# EAGLE design Filters (EAGLE 9.6.2)
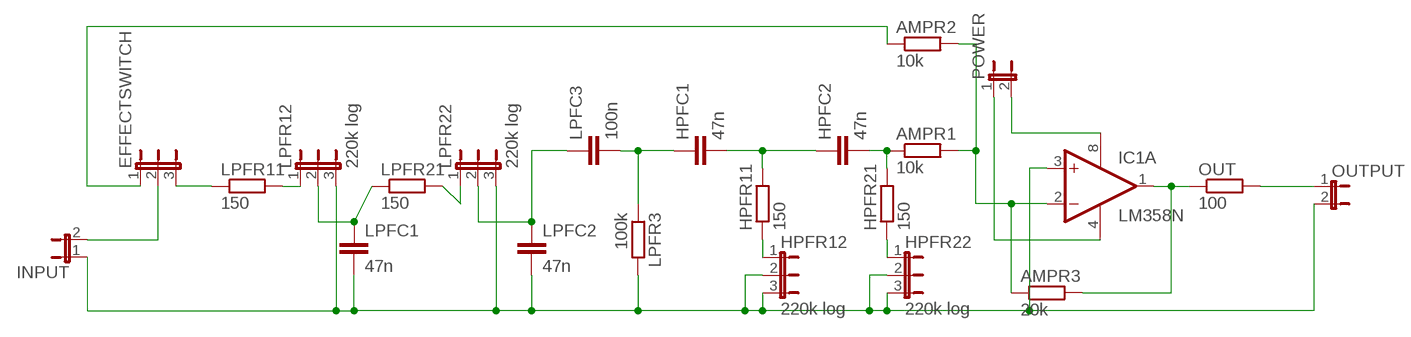
[diagram p0: schematic, sheet 1]

## Parts
AMPR1  10k  R-EU_0207/10  [0207/10]
AMPR2  10k  R-EU_0207/10  [0207/10]
AMPR3  20k  R-EU_0207/10  [0207/10]
EFFECTSWITCH  220k log  JP2E  [JP2]
HPFC1  47n  C-EU025-025X050  [C025-025X050]
HPFC2  47n  C-EU025-025X050  [C025-025X050]
HPFR11  150  R-EU_0207/10  [0207/10]
HPFR12  220k log  JP2E  [JP2]
HPFR21  150  R-EU_0207/10  [0207/10]
HPFR22  220k log  JP2E  [JP2]
IC1  LM358N  [DIL08]
INPUT  JP1E  [JP1]
LPFC1  47n  C-EU025-025X050  [C025-025X050]
LPFC2  47n  C-EU025-025X050  [C025-025X050]
LPFC3  100n  C-EU025-025X050  [C025-025X050]
LPFR3  100k  R-EU_0207/10  [0207/10]
LPFR11  150  R-EU_0207/10  [0207/10]
LPFR12  220k log  JP2E  [JP2]
LPFR21  150  R-EU_0207/10  [0207/10]
LPFR22  220k log  JP2E  [JP2]
OUT  100  R-EU_0207/10  [0207/10]
OUTPUT  JP1E  [JP1]
POWER  JP1E  [JP1]

## Nets
N$1: LPFR11.2 LPFR12.1
N$2: LPFC1.1 LPFR12.2 LPFR21.1
N$3: LPFC2.1 LPFC3.1 LPFR22.2
N$4: HPFR12.2 HPFR12.3 HPFR22.2 HPFR22.3 IC1.3(A:+IN) INPUT.1 LPFC1.2 LPFC2.2 LPFR3.2 LPFR12.3 LPFR22.3 OUTPUT.2
N$5: EFFECTSWITCH.3 LPFR11.1
N$6: HPFC1.2 HPFC2.1 HPFR11.2
N$8: AMPR3.2 IC1.1(A:OUT) OUT.1
N$9: IC1.8(P:V+) POWER.2
N$10: IC1.4(P:V-) POWER.1
N$11: OUT.2 OUTPUT.1
N$12: AMPR2.1 EFFECTSWITCH.1
N$13: LPFR21.2 LPFR22.1
N$14: HPFR21.1 HPFR22.1
N$15: AMPR1.1 HPFC2.2 HPFR21.2
N$16: HPFR11.1 HPFR12.1
N$19: HPFC1.1 LPFC3.2 LPFR3.1
N$21: EFFECTSWITCH.2 INPUT.2
N$22: AMPR1.2 AMPR2.2 AMPR3.1 IC1.2(A:-IN)
Unconnected: IC1.5(B:+IN) IC1.6(B:-IN) IC1.7(B:OUT)

## Library data of the parts
AMPR1-AMPR3 HPFR11 HPFR21 LPFR3 LPFR11 LPFR21 OUT = rcl:R-EU_: RESISTOR, European symbol; SPICEPREFIX: R
EFFECTSWITCH HPFR12 HPFR22 LPFR12 LPFR22 = jumper:JP2E: JUMPER
HPFC1 HPFC2 LPFC1-LPFC3 = rcl:C-EU: CAPACITOR, European symbol; SPICEPREFIX: C
IC1 = linear:LM358: OP AMP also LM158; LM258; LM2904 Source: http://cache.national.com/ds/LM/LM158.pdf
INPUT OUTPUT POWER = jumper:JP1E: JUMPER

## Board
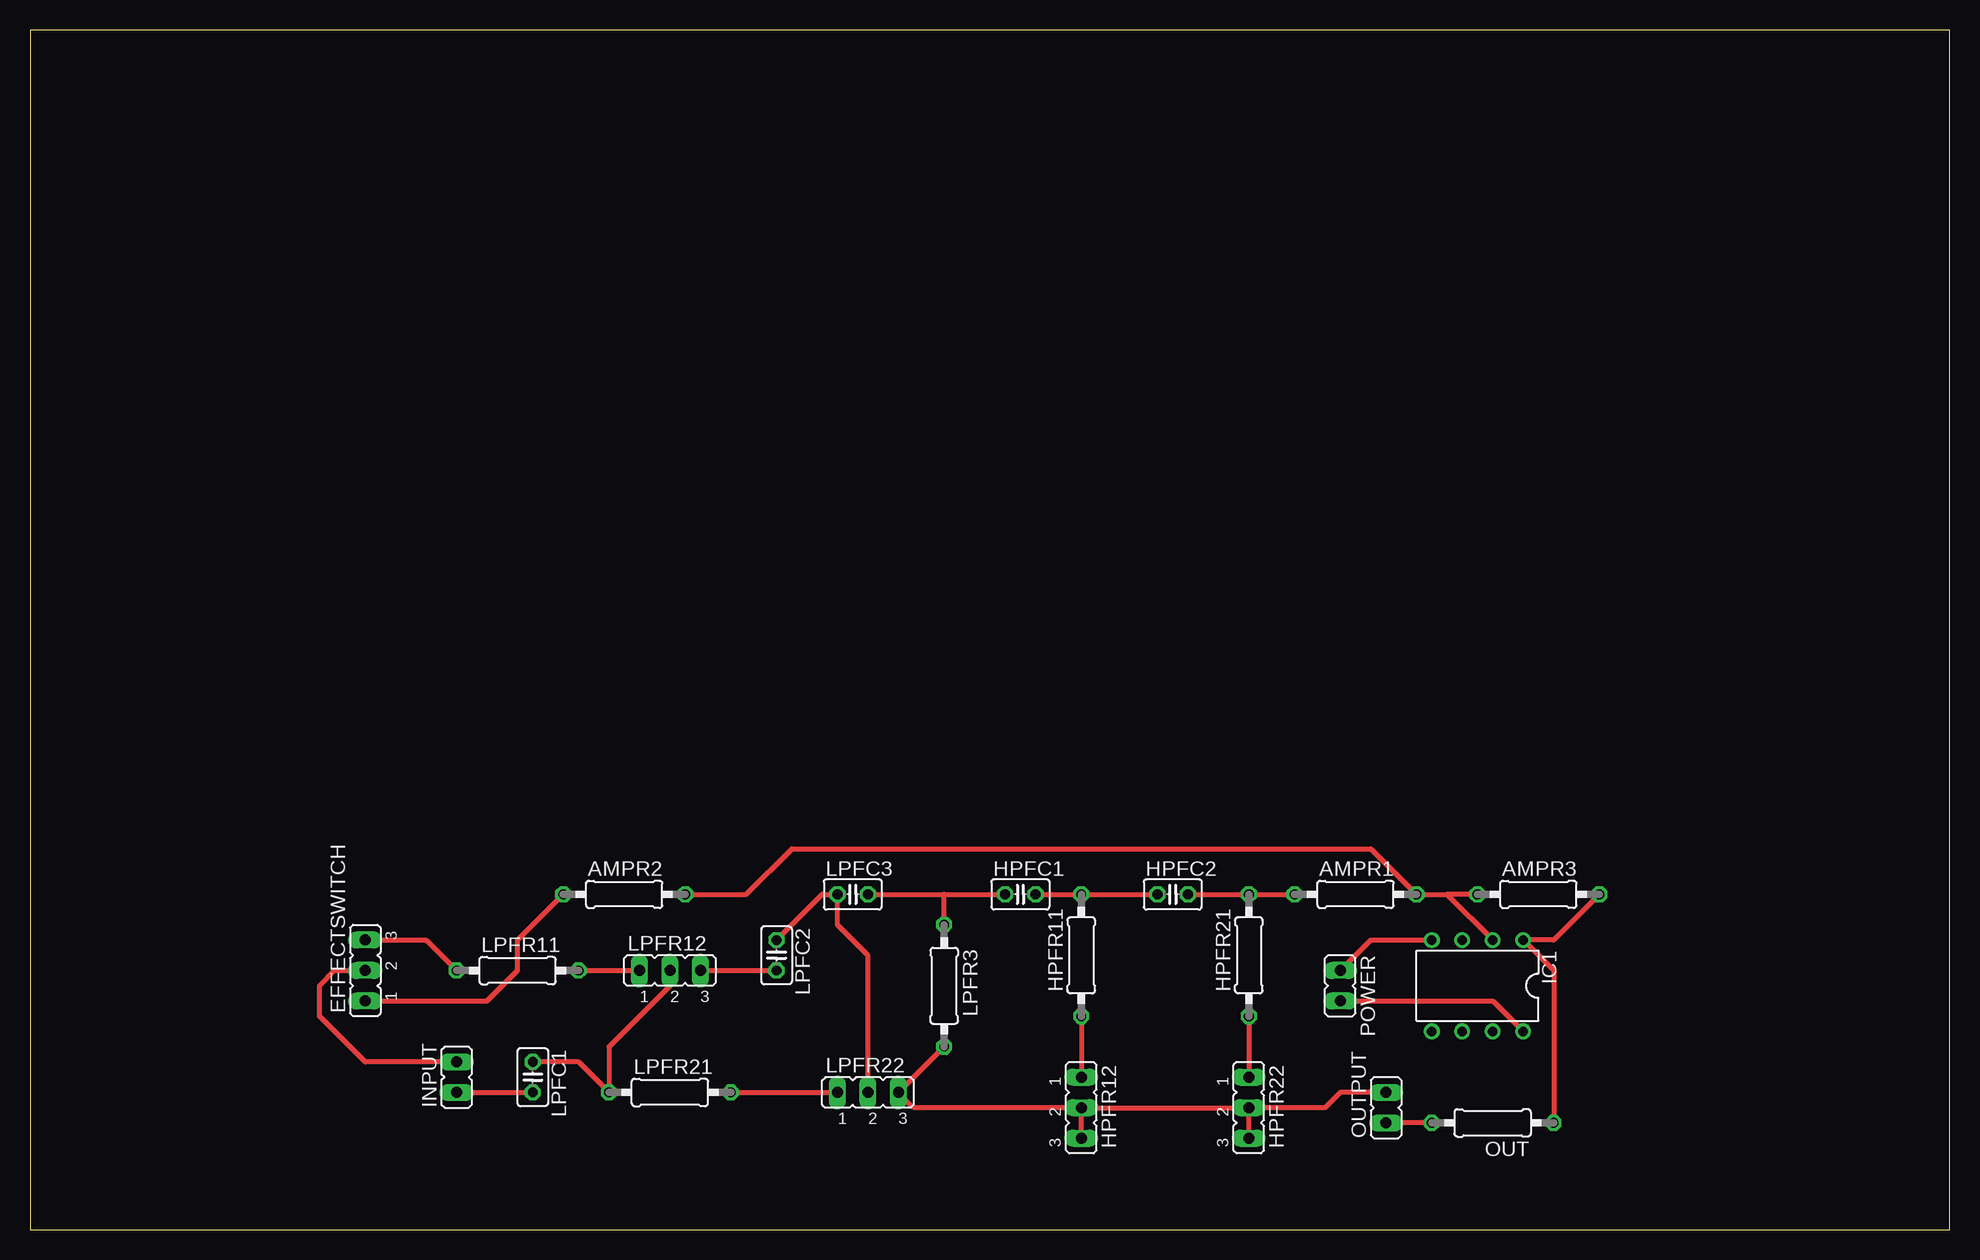
[diagram p1: board, top side]
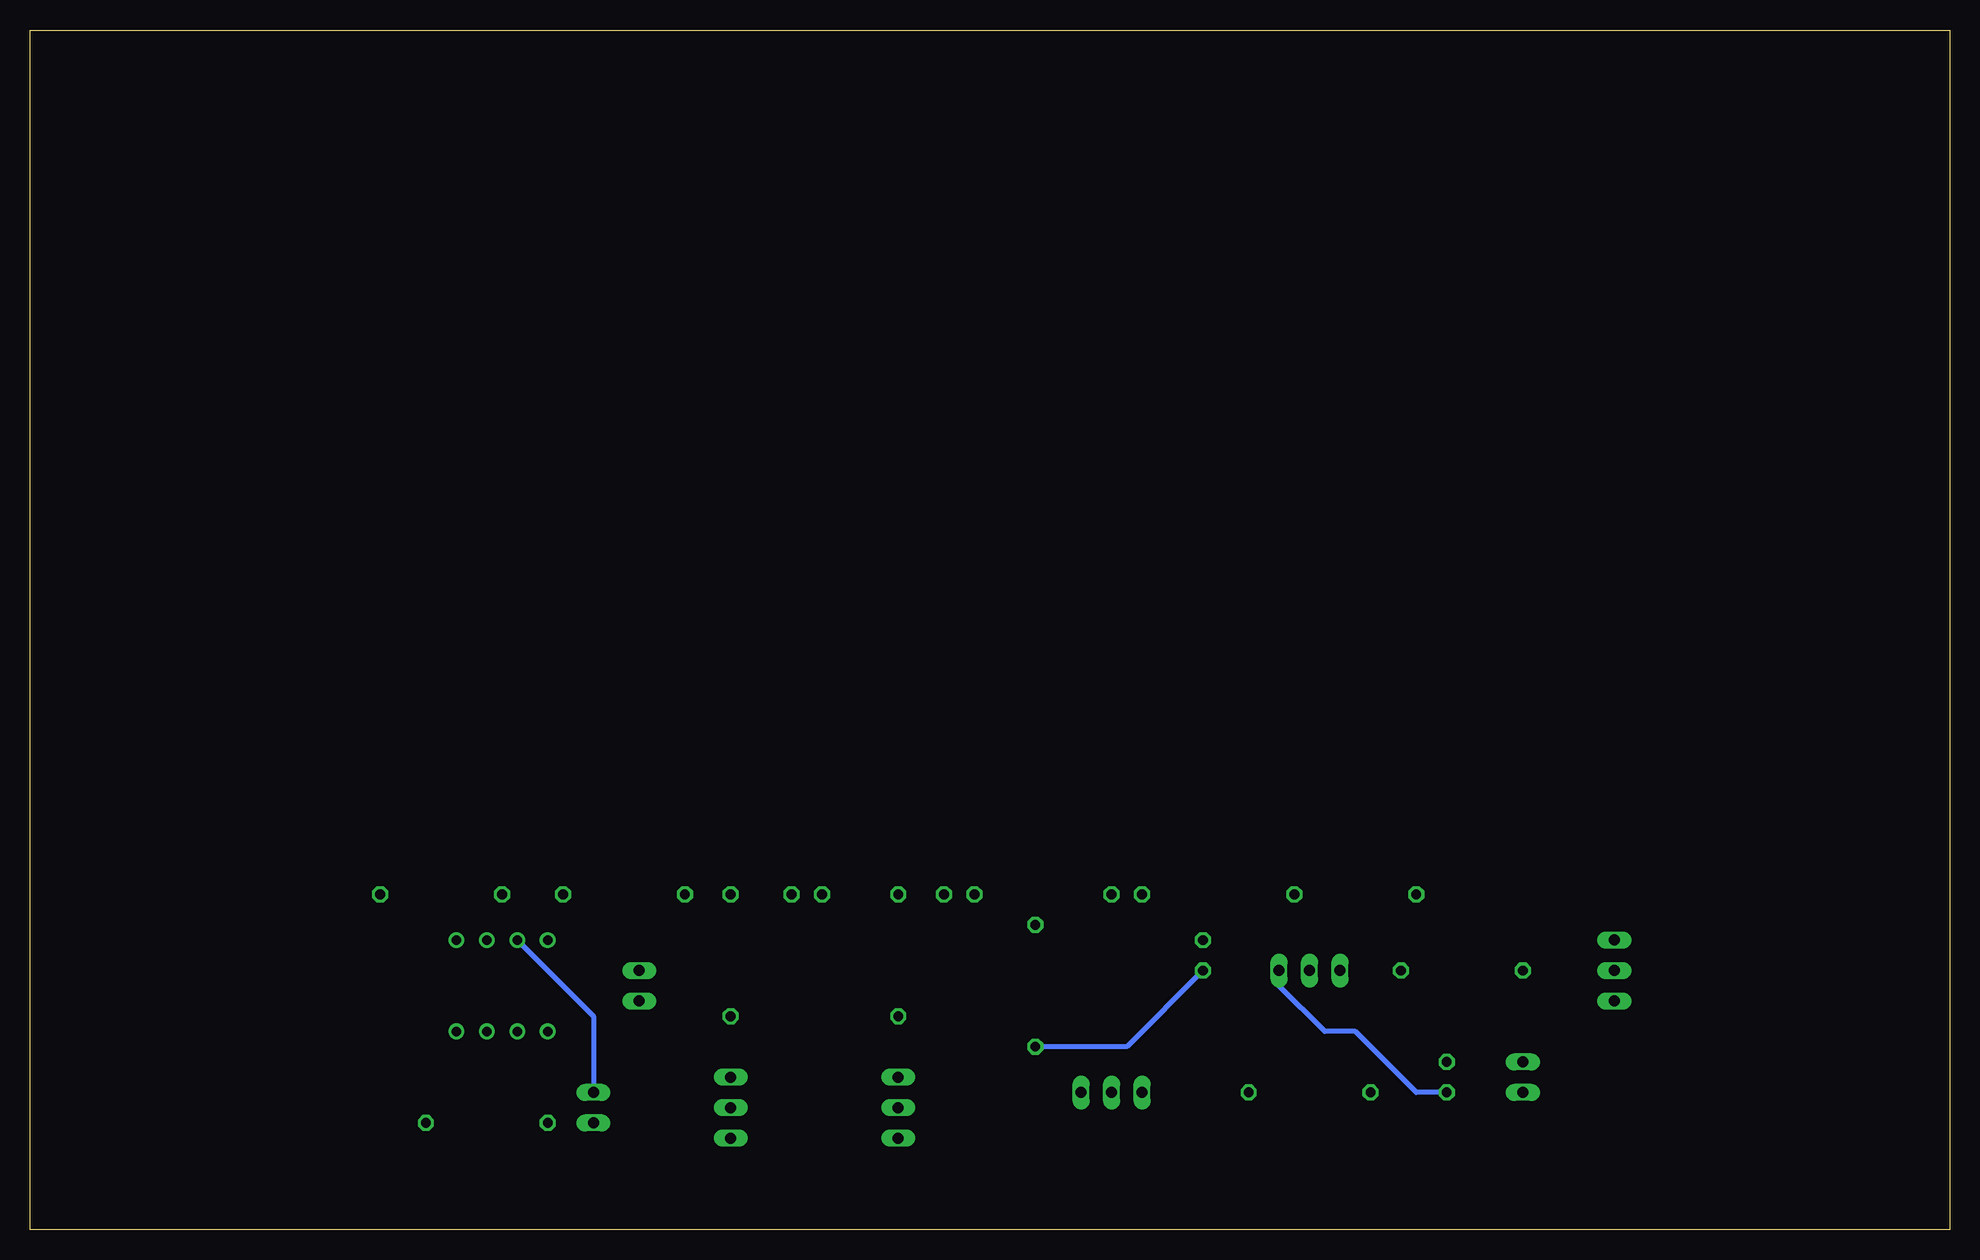
[diagram p2: board, bottom side, seen from below]

Size 160 x 100 mm. Coordinates in mm from the lower left corner, seen from the top.
Outline: 0,0 160,0 160,100 0,100 0,0
Copper layers (1*16): Top 0.035mm / dielectric 1.5mm / Bottom 0.035mm
Design rules "default": minimum track width 6mil, minimum drill 0.35mm, track to track 6mil, track to pad 6mil, pad to pad 6mil, via to via 6mil, smd to smd 6mil, copper to edge 40mil, drill to drill 6mil, minimum pad ring 10mil, minimum via ring 8mil, stop-mask expansion 4mil, vias tented up to drill 0mil, thermal gap 10mil

### Footprints (pad centres in the part's own frame; a part is rotated, then mirrored left to right if it is on the bottom)
0207/10 = drill 0.813 octagon: 1 -5.08,0; 2 5.08,0
JP2 = drill 0.914 long: 1 -2.54,0; 2 0,0; 3 2.54,0
C025-025X050 = drill 0.813 octagon: 1 -1.27,0; 2 1.27,0
DIL08 = drill 0.813 pad 1.27: 1 -3.81,-3.81; 2 -1.27,-3.81; 3 1.27,-3.81; 4 3.81,-3.81; 5 3.81,3.81; 6 1.27,3.81; 7 -1.27,3.81; 8 -3.81,3.81
JP1 = drill 0.914 long: 1 0,-1.27; 2 0,1.27

### Placement (x,y rotation side)
AMPR1  110.49,27.94 0 top
AMPR2  49.53,27.94 0 top
AMPR3  125.73,27.94 0 top
EFFECTSWITCH  27.94,21.59 90 top
HPFC1  82.55,27.94 0 top
HPFC2  95.25,27.94 0 top
HPFR11  87.63,22.86 90 top
HPFR12  87.63,10.16 270 top
HPFR21  101.6,22.86 90 top
HPFR22  101.6,10.16 270 top
IC1  120.65,20.32 180 top
INPUT  35.56,12.7 0 top
LPFC1  41.91,12.7 270 top
LPFC2  62.23,22.86 270 top
LPFC3  68.58,27.94 0 top
LPFR3  76.2,20.32 270 top
LPFR11  40.64,21.59 0 top
LPFR12  53.34,21.59 0 top
LPFR21  53.34,11.43 0 top
LPFR22  69.85,11.43 0 top
OUT  121.92,8.89 180 top
OUTPUT  113.03,10.16 0 top
POWER  109.22,20.32 180 top

### Tracks (layer width: path | path; a pad name or v marks a point on that pad's centre or on a via)
N$1
  Top 0.406: LPFR11.2 LPFR12.1
N$2
  Top 0.406: LPFC1.1 45.72,13.97 LPFR21.1 48.26,15.24 53.34,20.32 LPFR12.2
N$3
  Top 0.406: LPFC2.1 66.04,27.94 LPFC3.1 67.31,25.4 69.85,22.86 LPFR22.2
N$4
  Top 0.406: LPFR12.3 LPFC2.2 | HPFR22.2 107.95,10.16 109.22,11.43 OUTPUT.2 | HPFR12.2 HPFR22.2 | HPFR12.3 HPFR12.2 | HPFR22.3 HPFR22.2 | HPFR12.2 73.66,10.16 LPFR22.3 LPFR3.2 | INPUT.1 LPFC1.2
  Bottom 0.406: IC1.3 113.03,17.78 OUTPUT.2 | LPFC2.2 68.58,15.24 LPFR3.2 | LPFC1.2 44.45,11.43 49.53,16.51 52.07,16.51 55.88,20.32 LPFR12.3
N$5
  Top 0.406: EFFECTSWITCH.3 33.02,24.13 LPFR11.1
N$6
  Top 0.406: HPFC1.2 HPFR11.2 HPFC2.1
N$8
  Top 0.406: OUT.1 127,21.59 IC1.1 127,24.13 AMPR3.2
N$9
  Top 0.406: POWER.2 121.92,19.05 IC1.8
N$10
  Top 0.406: POWER.1 111.76,24.13 IC1.4
N$11
  Top 0.406: OUT.2 OUTPUT.1
N$12
  Top 0.406: EFFECTSWITCH.1 38.1,19.05 40.64,21.59 40.64,24.13 AMPR2.1
N$13
  Top 0.406: LPFR21.2 LPFR22.1
N$14
  Top 0.406: HPFR21.1 HPFR22.1
N$15
  Top 0.406: HPFC2.2 HPFR21.2 AMPR1.1
N$16
  Top 0.406: HPFR11.1 HPFR12.1
N$19
  Top 0.406: LPFC3.2 76.2,27.94 | 76.2,27.94 HPFC1.1 | LPFR3.1 76.2,27.94
N$21
  Top 0.406: INPUT.2 27.94,13.97 24.13,17.78 24.13,20.32 25.4,21.59 EFFECTSWITCH.2
N$22
  Top 0.406: 118.11,27.94 AMPR1.2 111.76,31.75 63.5,31.75 59.69,27.94 AMPR2.2 | 118.11,27.94 IC1.2 | AMPR3.1 118.11,27.94